# EAGLE schematic Beilage (EAGLE 9.6.2)
ABTEILUNG: Technische Informatik; BEARBEITER: Simon Grundner; DATUM: 2021//; DOKUMENTART: Schaltplan; GEZ: GruS; ID: 4AHEL; REV: 1; SCHALTPLAN: Sequencer; STATUS: Prototyp; VER: 2.0

## Sheet 1 of 5: Master Control
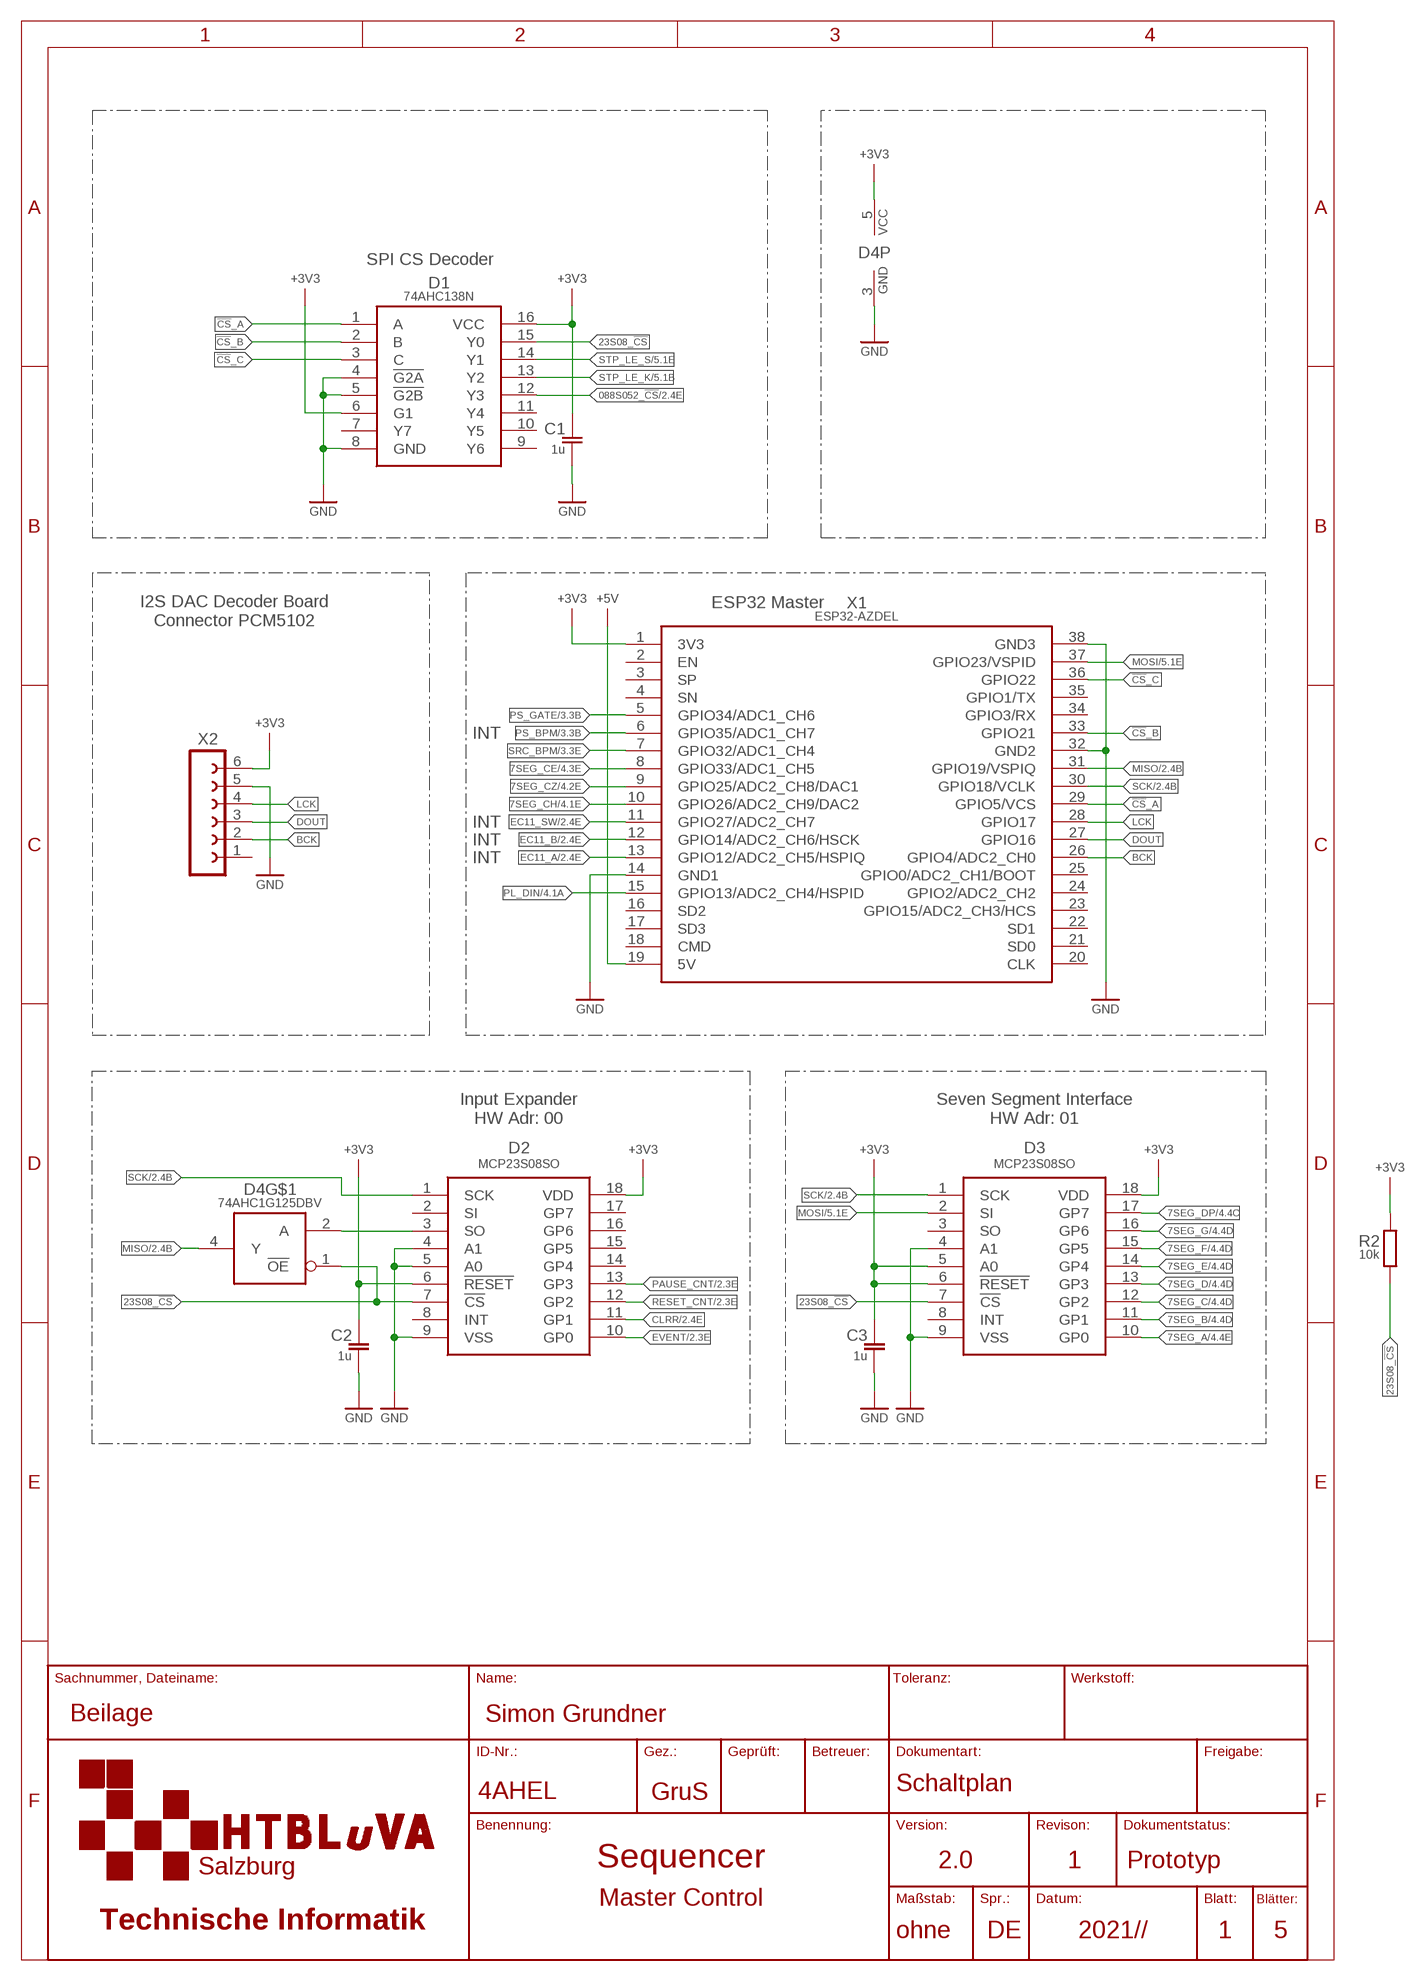
[diagram p0: schematic, sheet 1]

### Parts
C1  1u  C-EUC0805  [C0805]
C2  1u  C-EUC0805  [C0805]
C3  1u  C-EUC0805  [C0805]
D1  74AHC138N  [DIP16]
D2  MCP23S08SO  [SO18W]
D3  MCP23S08SO  [SO18W]
D4  74AHC1G125DBV  [SOT23-5]
R2  10k  R-EUSR0805  [R0805]
X1  ESP32-AZDEL  [ESP32-AZDEL]
X2  FE06-1  [FE06]

### Nets
7SEG_A: D3.10(GP0) ; also sheet 4
7SEG_B: D3.11(GP1) ; also sheet 4
7SEG_C: D3.12(GP2) ; also sheet 4
7SEG_CE: X1.8(GPIO33/ADC1_CH5) ; also sheet 4
7SEG_CH: X1.10(GPIO26/ADC2_CH9/DAC2) ; also sheet 4
7SEG_CZ: X1.9(GPIO25/ADC2_CH8/DAC1) ; also sheet 4
7SEG_D: D3.13(GP3) ; also sheet 4
7SEG_DP: D3.17(GP7) ; also sheet 4
7SEG_E: D3.14(GP4) ; also sheet 4
7SEG_F: D3.15(GP5) ; also sheet 4
7SEG_G: D3.16(GP6) ; also sheet 4
23S08_!CS: D1.15(Y0) D2.7(!CS) D3.7(!CS) D4.1(!OE) R2.1
088S052_!CS!: D1.12(Y3) ; also sheet 2
!CS!_A: D1.1(A) X1.29(GPIO5/VCS)
!CS!_B: D1.2(B) X1.33(GPIO21)
!CS!_C: D1.3(C) X1.36(GPIO22)
+3V3: C1.1 C2.1 C3.1 D1.6(G1) D1.16(VCC) D2.6(!RESET) D2.18(VDD) D3.5(A0) D3.6(!RESET) D3.18(VDD) D4.5(P:VCC) R2.2 X1.1(3V3) X2.6 ; also sheet 2,3,5
+5V: X1.19(5V) ; also sheet 4
BCK: X1.26(GPIO4/ADC2_CH0) X2.2
CLRR: D2.11(GP1) ; also sheet 2
DOUT: X1.27(GPIO16) X2.3
EC11_A: X1.13(GPIO12/ADC2_CH5/HSPIQ) ; also sheet 2
EC11_B: X1.12(GPIO14/ADC2_CH6/HSCK) ; also sheet 2
EC11_SW: X1.11(GPIO27/ADC2_CH7) ; also sheet 2
EVENT: D2.10(GP0) ; also sheet 2
GND: C1.2 C2.2 C3.2 D1.4(!G2A) D1.5(!G2B) D1.8(GND) D2.4(A1) D2.5(A0) D2.9(VSS) D3.4(A1) D3.9(VSS) D4.3(P:GND) X1.14(GND1) X1.32(GND2) X1.38(GND3) X2.5 ; also sheet 2,3,4,5
LCK: X1.28(GPIO17) X2.4
MISO: D4.4(Y) X1.31(GPIO19/VSPIQ) ; also sheet 2
MOSI: D3.2(SI) X1.37(GPIO23/VSPID) ; also sheet 5
N$62: D2.3(SO) D4.2(A)
PAUSE_CNT: D2.13(GP3) ; also sheet 2
PL_DIN: X1.15(GPIO13/ADC2_CH4/HSPID) ; also sheet 4
PS_BPM: X1.6(GPIO35/ADC1_CH7) ; also sheet 3
PS_GATE: X1.5(GPIO34/ADC1_CH6) ; also sheet 3
RESET_CNT: D2.12(GP2) ; also sheet 2
SCK: D2.1(SCK) D3.1(SCK) X1.30(GPIO18/VCLK) ; also sheet 2,5
SRC_BPM: X1.7(GPIO32/ADC1_CH4) ; also sheet 3
STP_LE_K: D1.13(Y2) ; also sheet 5
STP_LE_S: D1.14(Y1) ; also sheet 5
Unconnected: D1.7(Y7) D1.9(Y6) D1.10(Y5) D1.11(Y4) D2.2(SI) D2.8(INT) D2.14(GP4) D2.15(GP5) D2.16(GP6) D2.17(GP7) D3.3(SO) D3.8(INT) X1.2(EN) X1.3(SP) X1.4(SN) X1.16(SD2) X1.17(SD3) X1.18(CMD) X1.20(CLK) X1.21(SD0) X1.22(SD1) X1.23(GPIO15/ADC2_CH3/HCS) X1.24(GPIO2/ADC2_CH2) X1.25(GPIO0/ADC2_CH1/BOOT) X1.34(GPIO3/RX) X1.35(GPIO1/TX) X2.1

### Notes on the sheet
- SPI CS Decoder
- ESP32 Master
- I2S DAC Decoder Board
  Connector PCM5102
- INT
- INT
- INT
- INT
- Input Expander
  HW Adr: 00
- Seven Segment Interface
  HW Adr: 01

## Sheet 2 of 5: User Inputs Potentiometers for Pitch Settings Switch Inputs EC-11
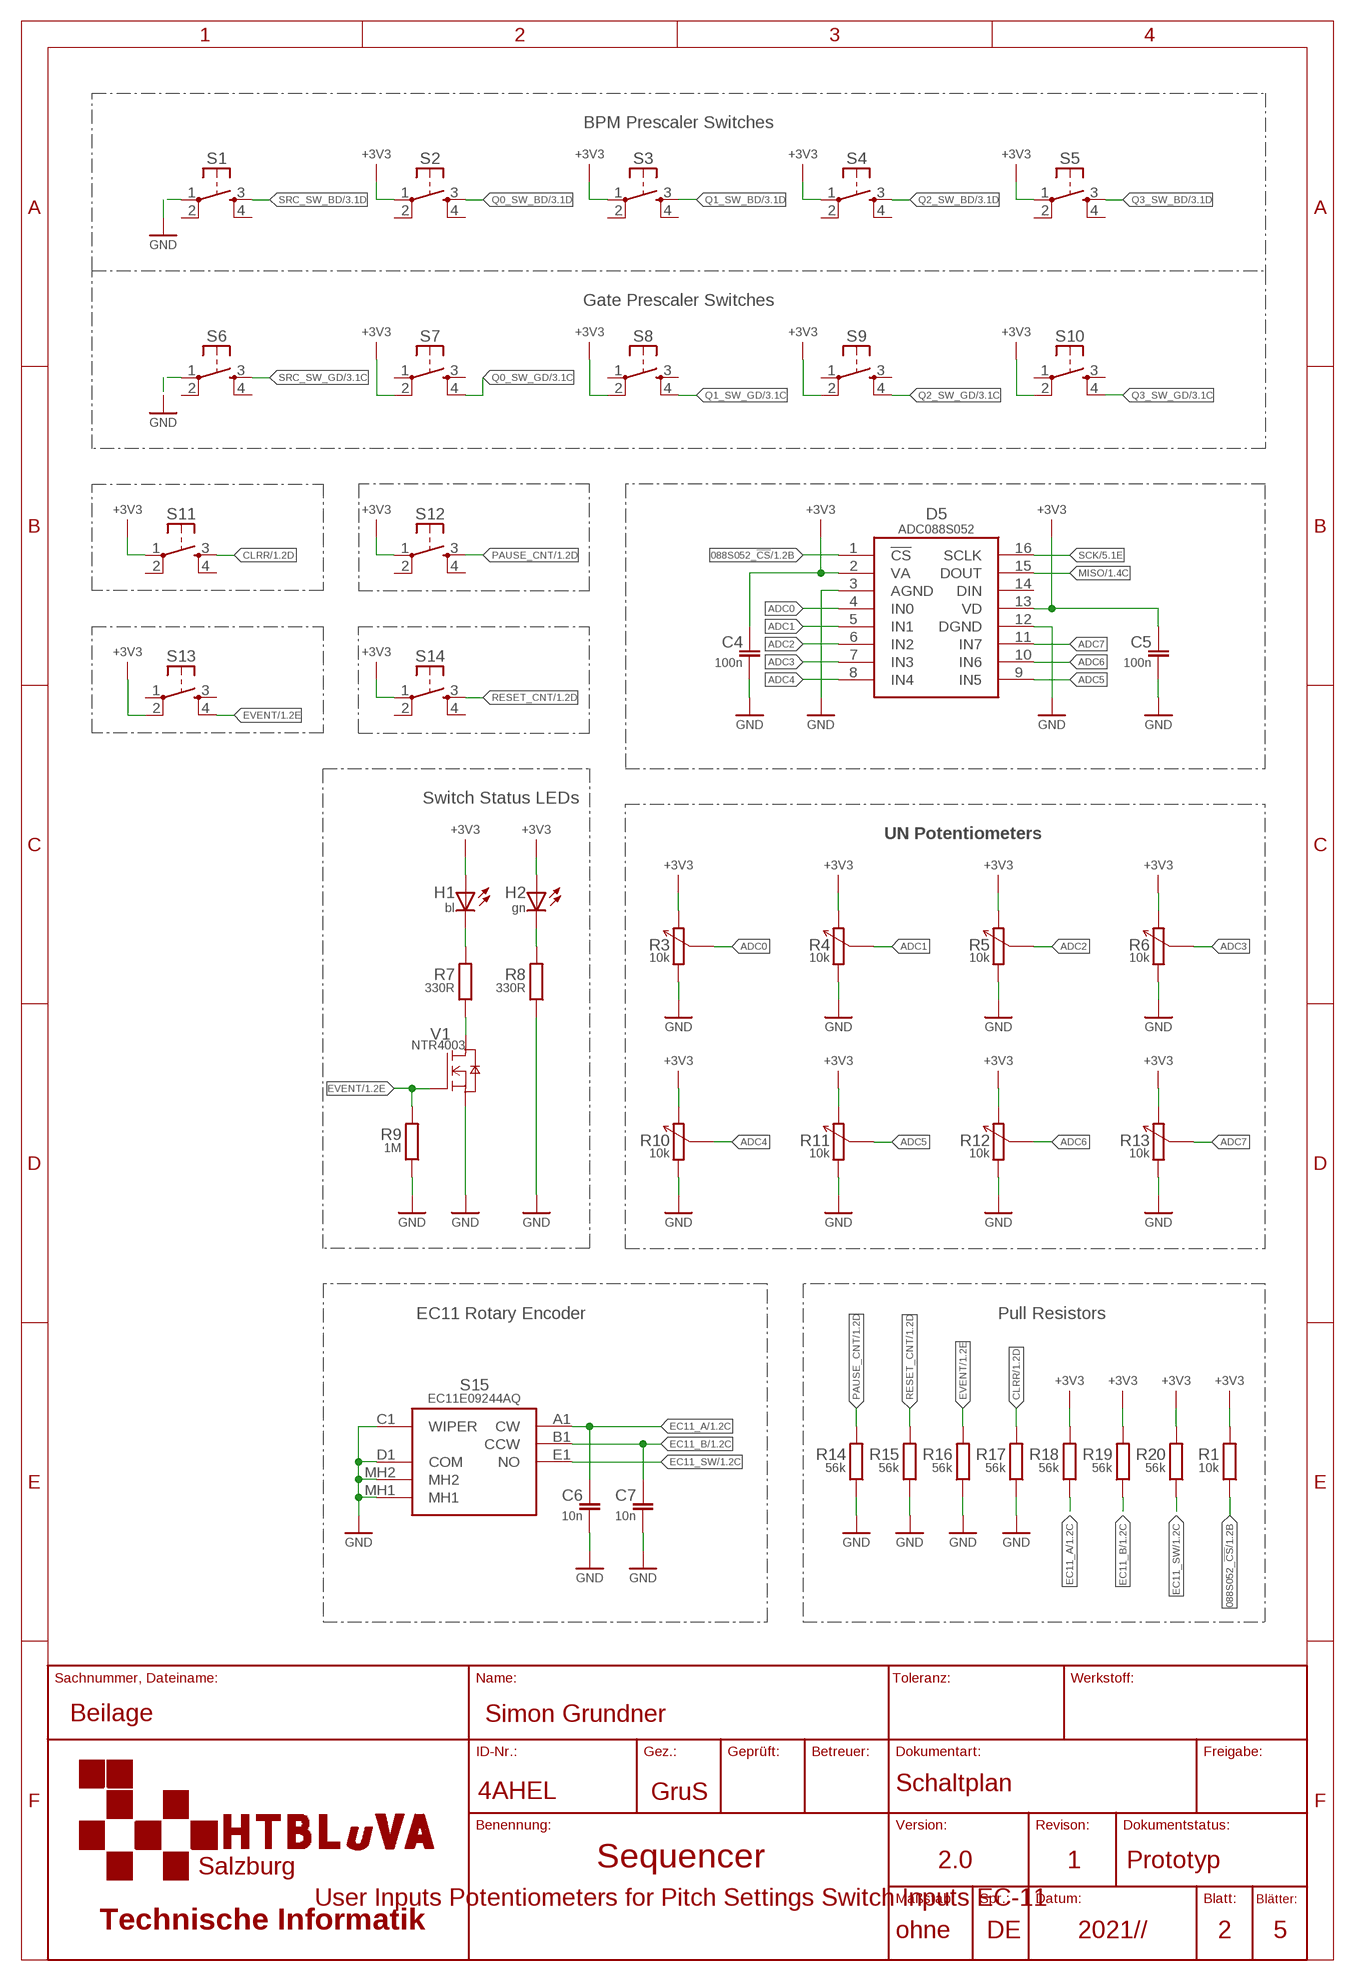
[diagram p1: schematic, sheet 2]

### Parts
C4  100n  C-EUC0805  [C0805]
C5  100n  C-EUC0805  [C0805]
C6  10n  C-EUC0805  [C0805]
C7  10n  C-EUC0805  [C0805]
D5  ADC088S052  [TSSOP16]
H1  bl  LEDCHIPLED_1206  [CHIPLED_1206]
H2  gn  LEDCHIPLED_1206  [CHIPLED_1206]
R1  10k  R-EUSR0805  [R0805]
R3  10k  P160L  [P160L]
R4  10k  P160L  [P160L]
R5  10k  P160L  [P160L]
R6  10k  P160L  [P160L]
R7  330R  R-EUSR0805  [R0805]
R8  330R  R-EUSR0805  [R0805]
R9  1M  R-EUSR0805  [R0805]
R10  10k  P160L  [P160L]
R11  10k  P160L  [P160L]
R12  10k  P160L  [P160L]
R13  10k  P160L  [P160L]
R14  56k  R-EUSR0805  [R0805]
R15  56k  R-EUSR0805  [R0805]
R16  56k  R-EUSR0805  [R0805]
R17  56k  R-EUSR0805  [R0805]
R18  56k  R-EUSR0805  [R0805]
R19  56k  R-EUSR0805  [R0805]
R20  56k  R-EUSR0805  [R0805]
S1  TASTE10XX  [B3F-10XX]
S2  TASTE10XX  [B3F-10XX]
S3  TASTE10XX  [B3F-10XX]
S4  TASTE10XX  [B3F-10XX]
S5  TASTE10XX  [B3F-10XX]
S6  TASTE10XX  [B3F-10XX]
S7  TASTE10XX  [B3F-10XX]
S8  TASTE10XX  [B3F-10XX]
S9  TASTE10XX  [B3F-10XX]
S10  TASTE10XX  [B3F-10XX]
S11  TASTE10XX  [B3F-10XX]
S12  TASTE10XX  [B3F-10XX]
S13  TASTE10XX  [B3F-10XX]
S14  TASTE10XX  [B3F-10XX]
S15  EC11E09244AQ  [EC11]
V1  NTR4003  [SOT23]

### Nets
088S052_!CS!: D5.1(!CS) R1.1 ; also sheet 1
+3V3: C4.1 C5.1 D5.2(VA) D5.13(VD) H1.A H2.A R1.2 R3.3 R4.3 R5.3 R6.3 R10.3 R11.3 R12.3 R13.3 R18.2 R19.2 R20.2 S2.1(P) S3.1(P) S4.1(P) S5.1(P) S7.2(P1) S8.2(P1) S9.2(P1) S10.2(P1) S11.1(P) S12.1(P) S13.2(P1) S14.1(P) ; also sheet 1,3,5
ADC0: D5.4(IN0) R3.2
ADC1: D5.5(IN1) R4.2
ADC2: D5.6(IN2) R5.2
ADC3: D5.7(IN3) R6.2
ADC4: D5.8(IN4) R10.2
ADC5: D5.9(IN5) R11.2
ADC6: D5.10(IN6) R12.2
ADC7: D5.11(IN7) R13.2
CLRR: R17.2 S11.3(S) ; also sheet 1
EC11_A: C6.1 R18.1 S15.A1(CW) ; also sheet 1
EC11_B: C7.1 R19.1 S15.B1(CCW) ; also sheet 1
EC11_SW: R20.1 S15.E1(NO) ; also sheet 1
EVENT: R9.2 R16.2 S13.4(S1) V1.1(G) ; also sheet 1
GND: C4.2 C5.2 C6.2 C7.2 D5.3(AGND) D5.12(DGND) R3.1 R4.1 R5.1 R6.1 R8.1 R9.1 R10.1 R11.1 R12.1 R13.1 R14.1 R15.1 R16.1 R17.1 S1.1(P) S6.1(P) S15.C1(WIPER) S15.D1(COM) S15.MH1 S15.MH2 V1.2(S) ; also sheet 1,3,4,5
MISO: D5.15(DOUT) ; also sheet 1
N$9: H2.C R8.2
N$58: H1.C R7.2
N$60: R7.1 V1.3(D)
PAUSE_CNT: R14.2 S12.3(S) ; also sheet 1
Q0_SW_BD: S2.3(S) ; also sheet 3
Q0_SW_GD: S7.4(S1) ; also sheet 3
Q1_SW_BD: S3.3(S) ; also sheet 3
Q1_SW_GD: S8.4(S1) ; also sheet 3
Q2_SW_BD: S4.3(S) ; also sheet 3
Q2_SW_GD: S9.4(S1) ; also sheet 3
Q3_SW_BD: S5.3(S) ; also sheet 3
Q3_SW_GD: S10.4(S1) ; also sheet 3
RESET_CNT: R15.2 S14.3(S) ; also sheet 1
SCK: D5.16(SCLK) ; also sheet 1,5
SRC_SW_BD: S1.3(S) ; also sheet 3
SRC_SW_GD: S6.3(S) ; also sheet 3
Unconnected: D5.14(DIN) S1.2(P1) S1.4(S1) S2.2(P1) S2.4(S1) S3.2(P1) S3.4(S1) S4.2(P1) S4.4(S1) S5.2(P1) S5.4(S1) S6.2(P1) S6.4(S1) S7.1(P) S7.3(S) S8.1(P) S8.3(S) S9.1(P) S9.3(S) S10.1(P) S10.3(S) S11.2(P1) S11.4(S1) S12.2(P1) S12.4(S1) S13.1(P) S13.3(S) S14.2(P1) S14.4(S1)

### Notes on the sheet
- BPM Prescaler Switches
- Gate Prescaler Switches
- Switch Status LEDs
- UN Potentiometers
- EC11 Rotary Encoder | Pull Resistors

## Sheet 3 of 5: Switch Matrix Switch Matrices for Division Factors
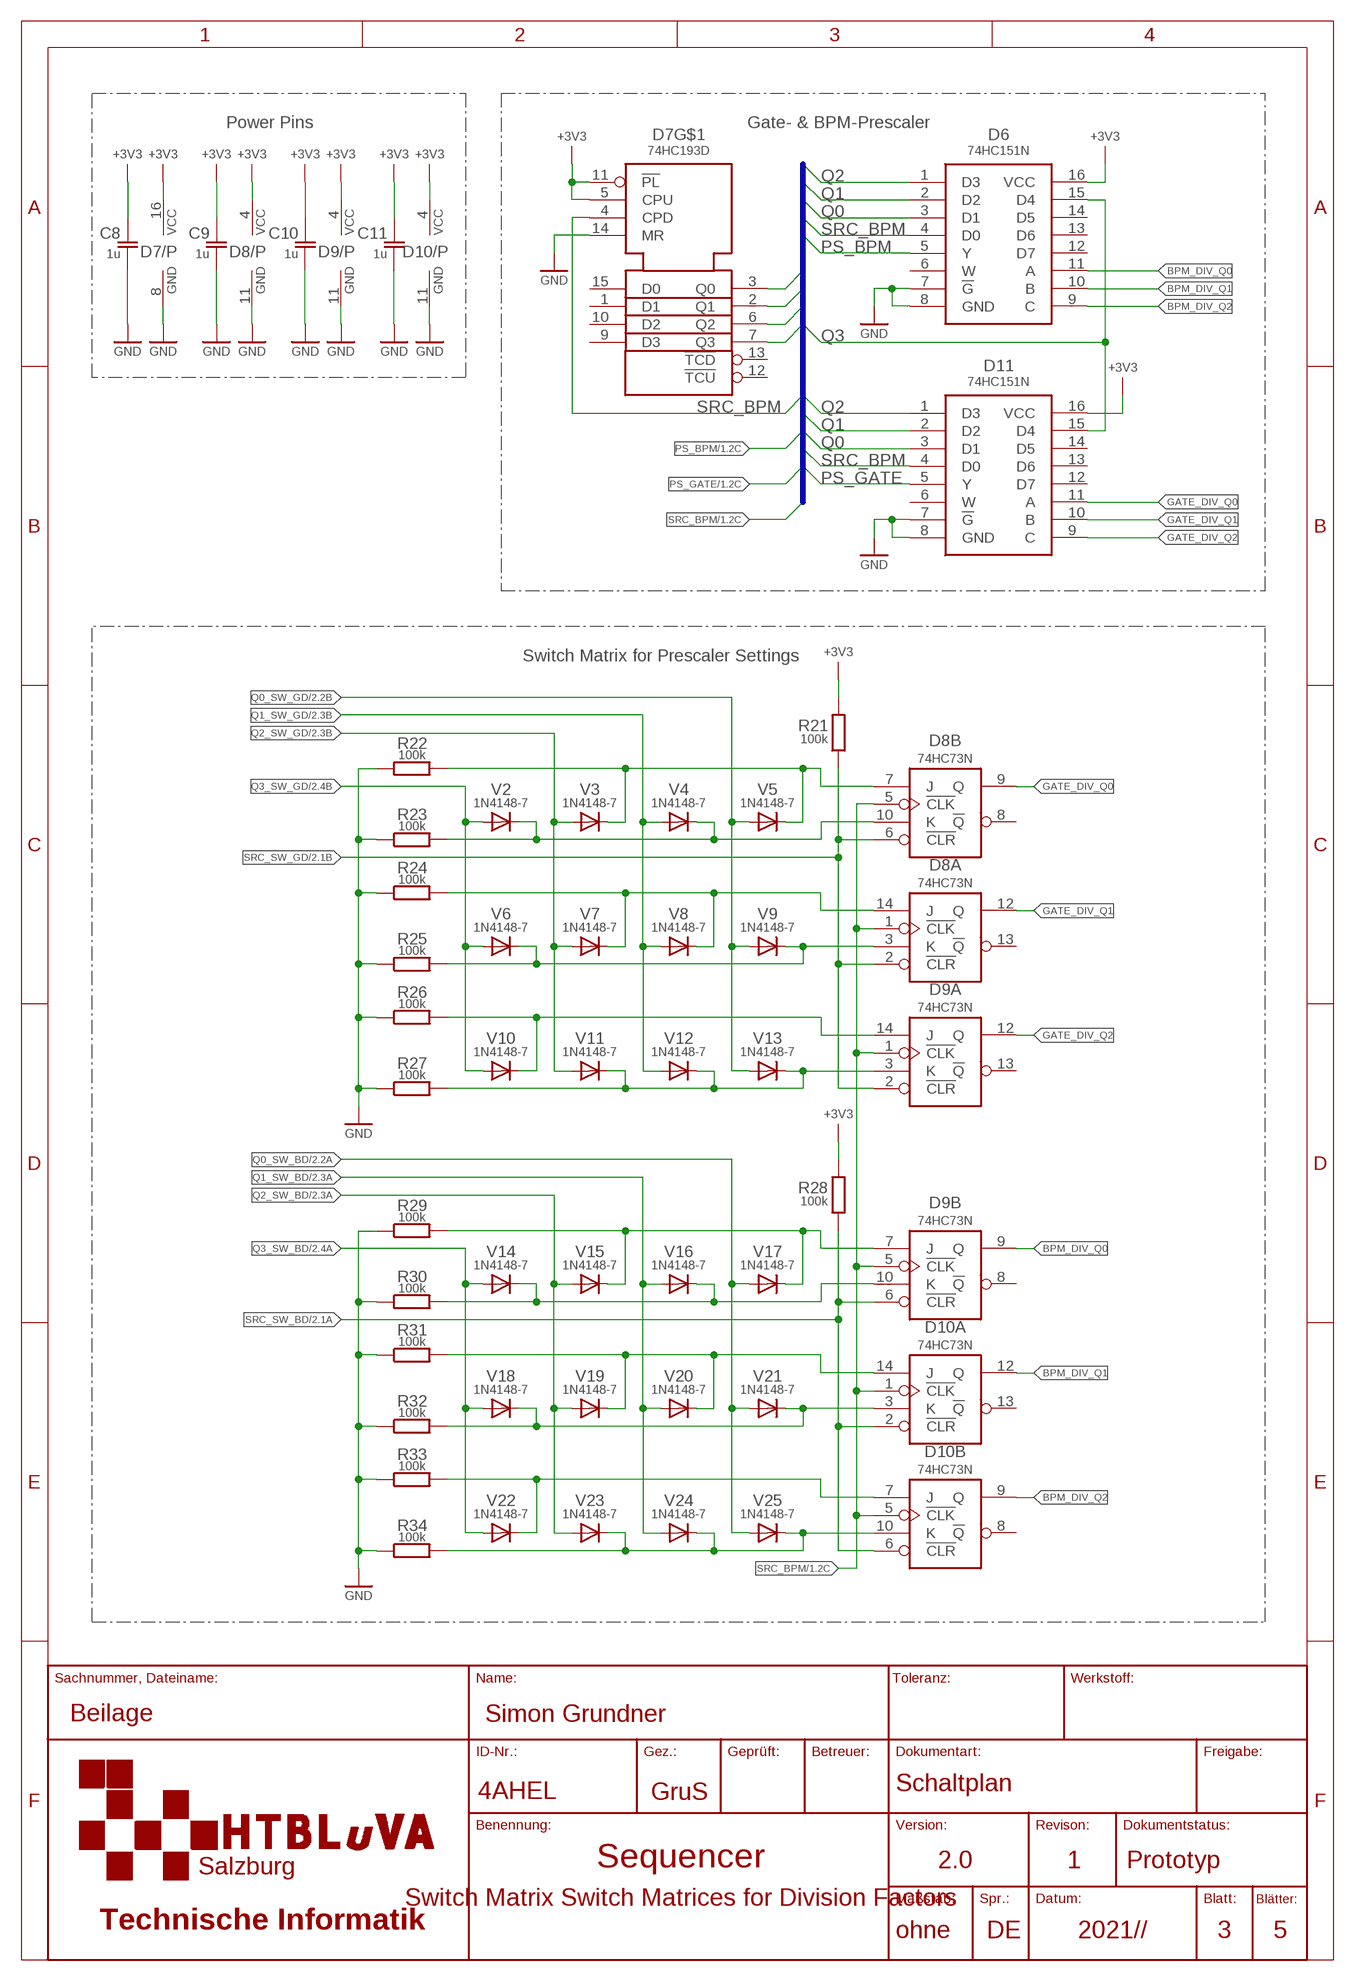
[diagram p2: schematic, sheet 3]

### Parts
C8  1u  C-EUC0805  [C0805]
C9  1u  C-EUC0805  [C0805]
C10  1u  C-EUC0805  [C0805]
C11  1u  C-EUC0805  [C0805]
D6  74HC151N  [DIP16]
D7  74HC193D  [SO16]
D8  74HC73N  [DIP14]
D9  74HC73N  [DIP14]
D10  74HC73N  [DIP14]
D11  74HC151N  [DIP16]
R21  100k  R-EUSR0805  [R0805]
R22  100k  R-EU_R0805  [R0805]
R23  100k  R-EU_R0805  [R0805]
R24  100k  R-EU_R0805  [R0805]
R25  100k  R-EU_R0805  [R0805]
R26  100k  R-EU_R0805  [R0805]
R27  100k  R-EU_R0805  [R0805]
R28  100k  R-EUSR0805  [R0805]
R29  100k  R-EU_R0805  [R0805]
R30  100k  R-EU_R0805  [R0805]
R31  100k  R-EU_R0805  [R0805]
R32  100k  R-EU_R0805  [R0805]
R33  100k  R-EU_R0805  [R0805]
R34  100k  R-EU_R0805  [R0805]
V2  1N4148-7  [DO35-7]
V3  1N4148-7  [DO35-7]
V4  1N4148-7  [DO35-7]
V5  1N4148-7  [DO35-7]
V6  1N4148-7  [DO35-7]
V7  1N4148-7  [DO35-7]
V8  1N4148-7  [DO35-7]
V9  1N4148-7  [DO35-7]
V10  1N4148-7  [DO35-7]
V11  1N4148-7  [DO35-7]
V12  1N4148-7  [DO35-7]
V13  1N4148-7  [DO35-7]
V14  1N4148-7  [DO35-7]
V15  1N4148-7  [DO35-7]
V16  1N4148-7  [DO35-7]
V17  1N4148-7  [DO35-7]
V18  1N4148-7  [DO35-7]
V19  1N4148-7  [DO35-7]
V20  1N4148-7  [DO35-7]
V21  1N4148-7  [DO35-7]
V22  1N4148-7  [DO35-7]
V23  1N4148-7  [DO35-7]
V24  1N4148-7  [DO35-7]
V25  1N4148-7  [DO35-7]

### Nets
+3V3: C8.1 C9.1 C10.1 C11.1 D6.16(VCC) D7.5(CPU) D7.11(!PL) D7.16(/P:VCC) D8.4(/P:VCC) D9.4(/P:VCC) D10.4(/P:VCC) D11.16(VCC) R21.2 R28.2 ; also sheet 1,2,5
BPM_DIV_Q0: D6.11(A) D9.9(B:Q)
BPM_DIV_Q1: D6.10(B) D10.12(A:Q)
BPM_DIV_Q2: D6.9(C) D10.9(B:Q)
GATE_DIV_Q0: D8.9(B:Q) D11.11(A)
GATE_DIV_Q1: D8.12(A:Q) D11.10(B)
GATE_DIV_Q2: D9.12(A:Q) D11.9(C)
GND: C8.2 C9.2 C10.2 C11.2 D6.7(!G) D6.8(GND) D7.8(/P:GND) D7.14(MR) D8.11(/P:GND) D9.11(/P:GND) D10.11(/P:GND) D11.7(!G) D11.8(GND) R22.1 R23.1 R24.1 R25.1 R26.1 R27.1 R29.1 R30.1 R31.1 R32.1 R33.1 R34.1 ; also sheet 1,2,4,5
N$1: D9.14(A:J) R26.2 V10.C
N$2: D8.10(B:K) R23.2 V2.C V4.C
N$3: D8.14(A:J) R24.2 V7.C V8.C
N$5: D8.7(B:J) R22.2 V3.C V5.C
N$6: D9.3(A:K) R27.2 V11.C V12.C V13.C
N$14: D8.3(A:K) R25.2 V6.C V9.C
N$15: D9.10(B:K) R30.2 V14.C V16.C
N$16: D10.10(B:K) R34.2 V23.C V24.C V25.C
N$17: D10.7(B:J) R33.2 V22.C
N$18: D10.14(A:J) R31.2 V19.C V20.C
N$19: D9.7(B:J) R29.2 V15.C V17.C
N$34: D10.3(A:K) R32.2 V18.C V21.C
PS_BPM: D6.5(Y) ; also sheet 1
PS_GATE: D11.5(Y) ; also sheet 1
Q0: D6.3(D1) D7.3(Q0) D11.3(D1)
Q0_SW_BD: V17.A V21.A V25.A ; also sheet 2
Q0_SW_GD: V5.A V9.A V13.A ; also sheet 2
Q1: D6.2(D2) D7.2(Q1) D11.2(D2)
Q1_SW_BD: V16.A V20.A V24.A ; also sheet 2
Q1_SW_GD: V4.A V8.A V12.A ; also sheet 2
Q2: D6.1(D3) D7.6(Q2) D11.1(D3)
Q2_SW_BD: V15.A V19.A V23.A ; also sheet 2
Q2_SW_GD: V3.A V7.A V11.A ; also sheet 2
Q3: D6.15(D4) D7.7(Q3) D11.15(D4)
Q3_SW_BD: V14.A V18.A V22.A ; also sheet 2
Q3_SW_GD: V2.A V6.A V10.A ; also sheet 2
SRC_BPM: D6.4(D0) D7.4(CPD) D8.1(A:!CLK) D8.5(B:!CLK) D9.1(A:!CLK) D9.5(B:!CLK) D10.1(A:!CLK) D10.5(B:!CLK) D11.4(D0) ; also sheet 1
SRC_SW_BD: D9.6(B:!CLR) D10.2(A:!CLR) D10.6(B:!CLR) R28.1 ; also sheet 2
SRC_SW_GD: D8.2(A:!CLR) D8.6(B:!CLR) D9.2(A:!CLR) R21.1 ; also sheet 2
Unconnected: D6.6(W) D6.12(D7) D6.13(D6) D6.14(D5) D7.1(D1) D7.9(D3) D7.10(D2) D7.12(!TCU) D7.13(!TCD) D7.15(D0) D8.8(B:!Q) D8.13(A:!Q) D9.8(B:!Q) D9.13(A:!Q) D10.8(B:!Q) D10.13(A:!Q) D11.6(W) D11.12(D7) D11.13(D6) D11.14(D5)

### Buses
PS_BPM,PS_GATE,Q0,Q1,Q2,Q3,SRC_BPM

### Notes on the sheet
- Power Pins | Gate- & BPM-Prescaler
- Switch Matrix for Prescaler Settings

## Sheet 4 of 5: Display & LEDs PL9823-F5 Rotating LEDs 7 Segment Display
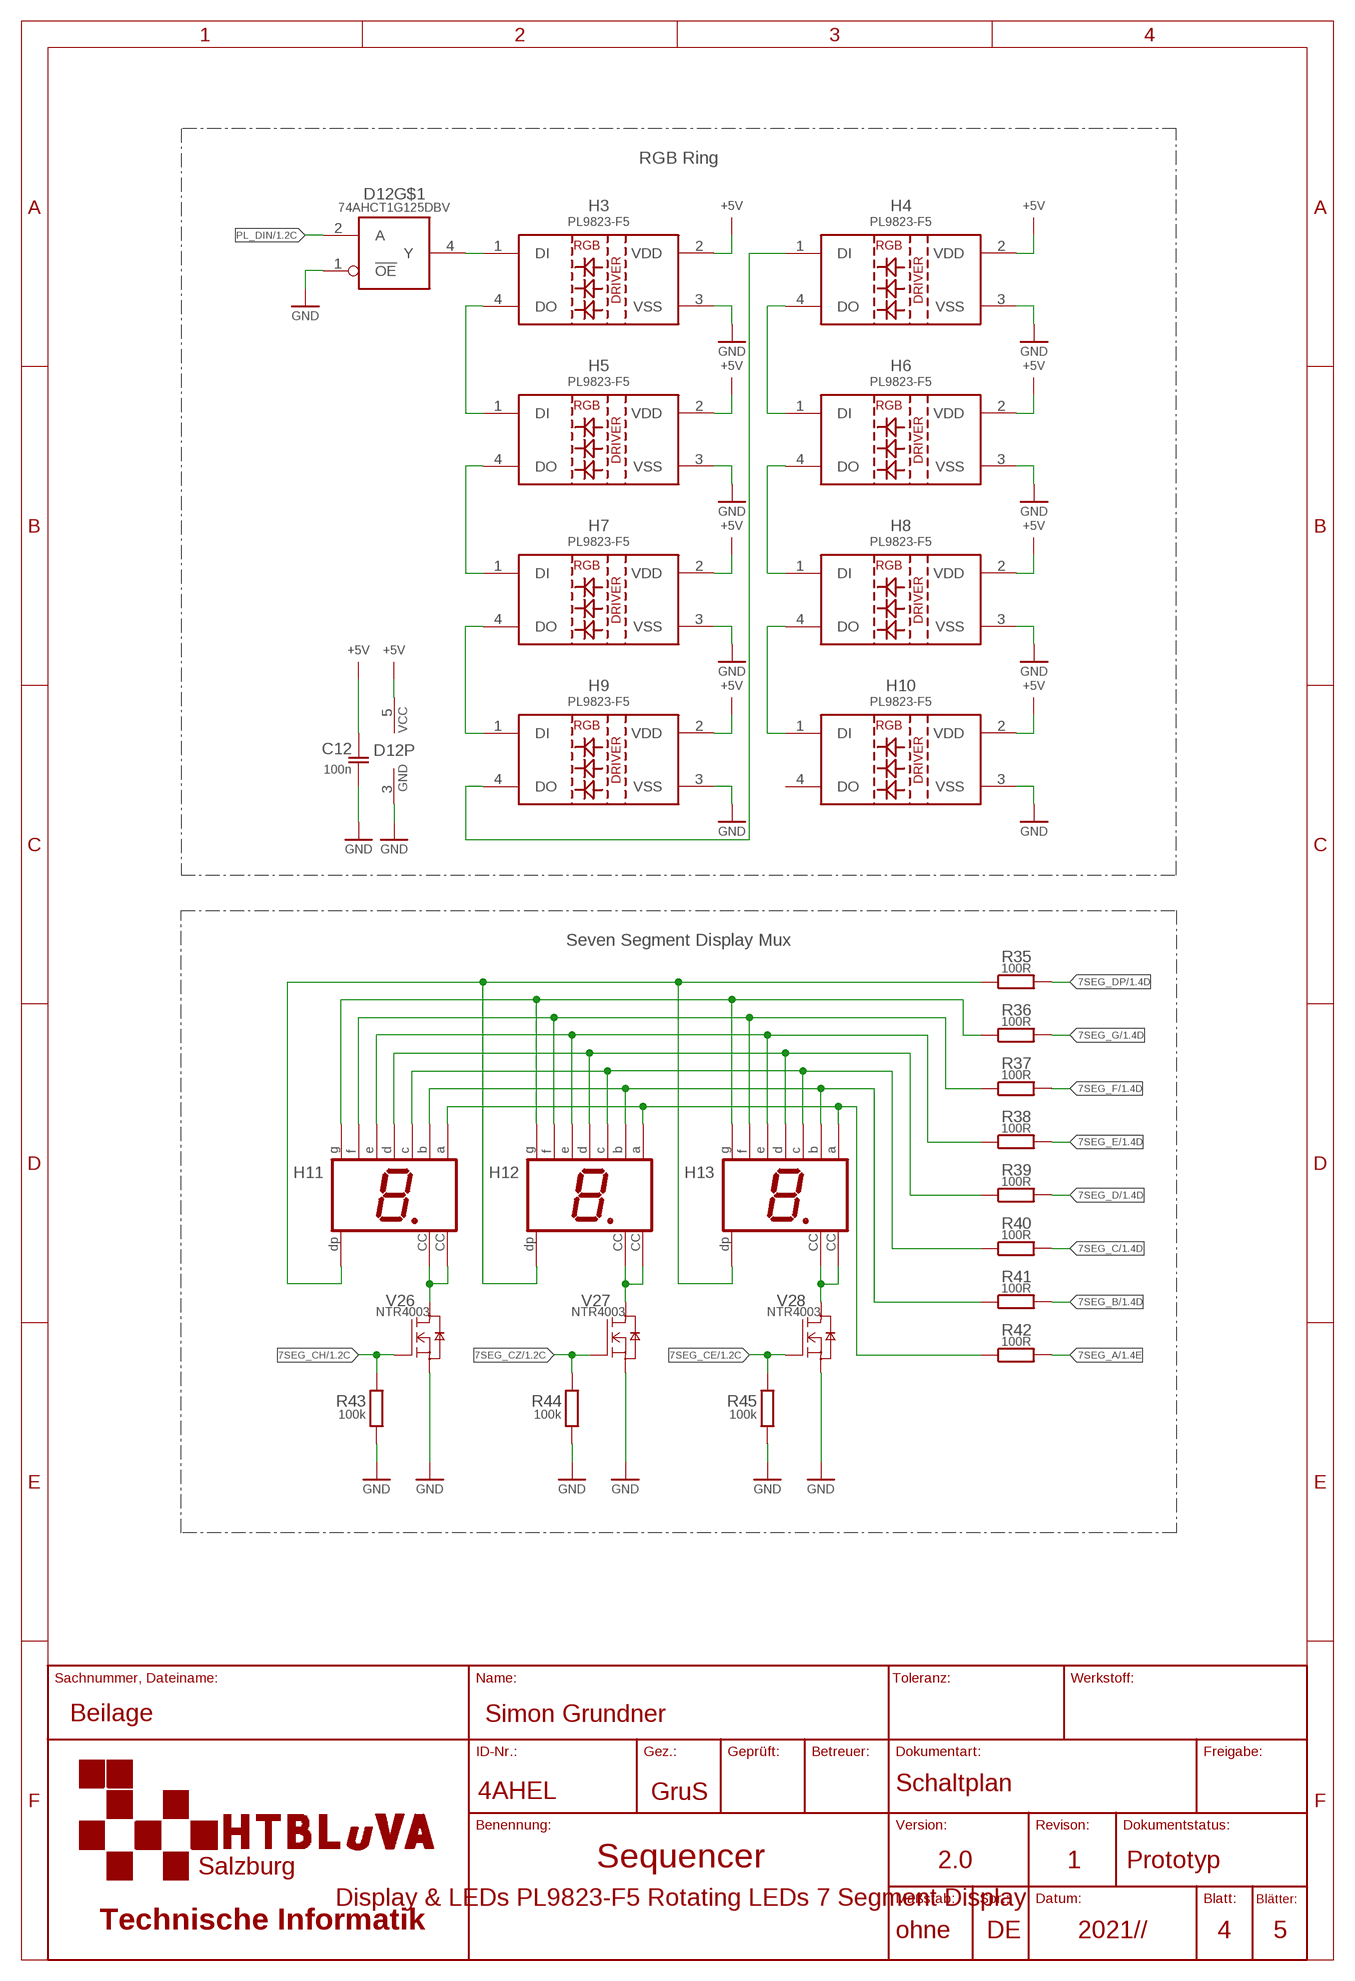
[diagram p3: schematic, sheet 4]

### Parts
C12  100n  C-EUC0805  [C0805]
D12  74AHCT1G125DBV  [SOT23-5]
H3  PL9823-F5  [LED-PL9823-F5]
H4  PL9823-F5  [LED-PL9823-F5]
H5  PL9823-F5  [LED-PL9823-F5]
H6  PL9823-F5  [LED-PL9823-F5]
H7  PL9823-F5  [LED-PL9823-F5]
H8  PL9823-F5  [LED-PL9823-F5]
H9  PL9823-F5  [LED-PL9823-F5]
H10  PL9823-F5  [LED-PL9823-F5]
H11  HD-H103  [HDSP-E]
H12  HD-H103  [HDSP-E]
H13  HD-H103  [HDSP-E]
R35  100R  R-EU_R0805  [R0805]
R36  100R  R-EU_R0805  [R0805]
R37  100R  R-EU_R0805  [R0805]
R38  100R  R-EU_R0805  [R0805]
R39  100R  R-EU_R0805  [R0805]
R40  100R  R-EU_R0805  [R0805]
R41  100R  R-EU_R0805  [R0805]
R42  100R  R-EU_R0805  [R0805]
R43  100k  R-EUSR0805  [R0805]
R44  100k  R-EUSR0805  [R0805]
R45  100k  R-EUSR0805  [R0805]
V26  NTR4003  [SOT23]
V27  NTR4003  [SOT23]
V28  NTR4003  [SOT23]

### Nets
7SEG_A: R42.2 ; also sheet 1
7SEG_B: R41.2 ; also sheet 1
7SEG_C: R40.2 ; also sheet 1
7SEG_CE: R45.2 V28.1(G) ; also sheet 1
7SEG_CH: R43.2 V26.1(G) ; also sheet 1
7SEG_CZ: R44.2 V27.1(G) ; also sheet 1
7SEG_D: R39.2 ; also sheet 1
7SEG_DP: R35.2 ; also sheet 1
7SEG_E: R38.2 ; also sheet 1
7SEG_F: R37.2 ; also sheet 1
7SEG_G: R36.2 ; also sheet 1
+5V: C12.1 D12.5(P:VCC) H3.2(VDD) H4.2(VDD) H5.2(VDD) H6.2(VDD) H7.2(VDD) H8.2(VDD) H9.2(VDD) H10.2(VDD) ; also sheet 1
GND: C12.2 D12.1(!OE) D12.3(P:GND) H3.3(VSS) H4.3(VSS) H5.3(VSS) H6.3(VSS) H7.3(VSS) H8.3(VSS) H9.3(VSS) H10.3(VSS) R43.1 R44.1 R45.1 V26.2(S) V27.2(S) V28.2(S) ; also sheet 1,2,3,5
N$4: H4.1(DI) H9.4(DO)
N$7: H11.DP H12.DP H13.DP R35.1
N$8: D12.4(Y) H3.1(DI)
N$33: H11.G H12.G H13.G R36.1
N$35: H11.F H12.F H13.F R37.1
N$36: H11.A H12.A H13.A R42.1
N$37: H11.B H12.B H13.B R41.1
N$55: H11.CC1(CC) H11.CC2(CC) V26.3(D)
N$56: H11.D H12.D H13.D R39.1
N$57: H4.4(DO) H6.1(DI)
N$59: H6.4(DO) H8.1(DI)
N$63: H8.4(DO) H10.1(DI)
N$64: H12.CC1(CC) H12.CC2(CC) V27.3(D)
N$65: H13.CC1(CC) H13.CC2(CC) V28.3(D)
N$68: H3.4(DO) H5.1(DI)
N$70: H5.4(DO) H7.1(DI)
N$73: H7.4(DO) H9.1(DI)
N$78: H11.C H12.C H13.C R40.1
N$80: H11.E H12.E H13.E R38.1
PL_DIN: D12.2(A) ; also sheet 1
Unconnected: H10.4(DO)

### Notes on the sheet
- RGB Ring
- Seven Segment Display Mux

## Sheet 5 of 5: LED Driver LED Register PL-9823-F5 LEDs
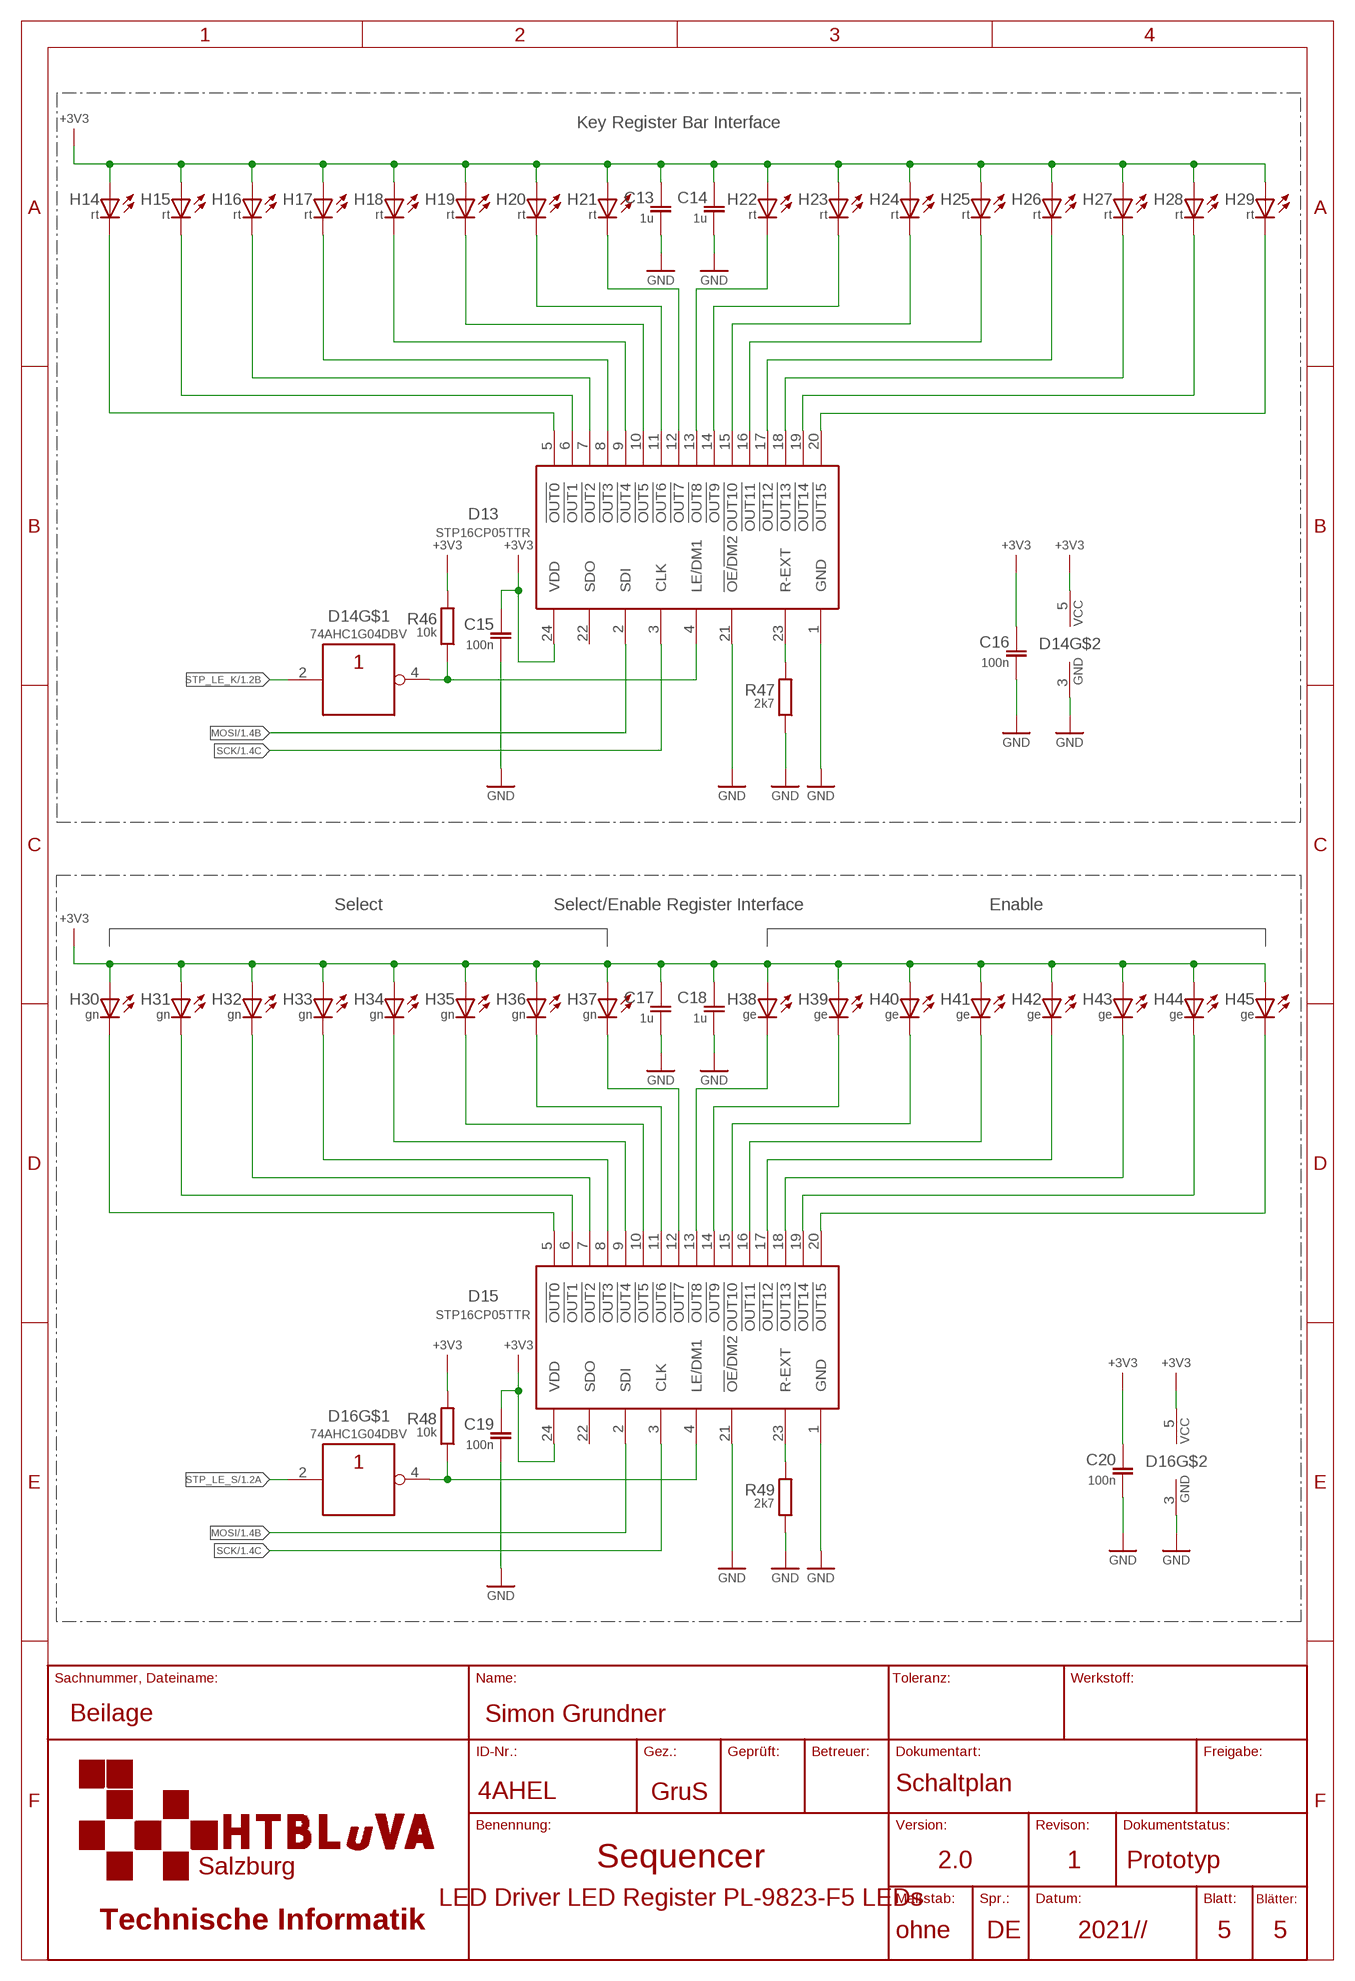
[diagram p4: schematic, sheet 5]

### Parts
C13  1u  C-EUC0805  [C0805]
C14  1u  C-EUC0805  [C0805]
C15  100n  C-EUC0805  [C0805]
C16  100n  C-EUC0805  [C0805]
C17  1u  C-EUC0805  [C0805]
C18  1u  C-EUC0805  [C0805]
C19  100n  C-EUC0805  [C0805]
C20  100n  C-EUC0805  [C0805]
D13  STP16CP05TTR  [TSSOP24]
D14  74AHC1G04DBV  [SOT23-5]
D15  STP16CP05TTR  [TSSOP24]
D16  74AHC1G04DBV  [SOT23-5]
H14  rt  LEDCHIPLED_1206  [CHIPLED_1206]
H15  rt  LEDCHIPLED_1206  [CHIPLED_1206]
H16  rt  LEDCHIPLED_1206  [CHIPLED_1206]
H17  rt  LEDCHIPLED_1206  [CHIPLED_1206]
H18  rt  LEDCHIPLED_1206  [CHIPLED_1206]
H19  rt  LEDCHIPLED_1206  [CHIPLED_1206]
H20  rt  LEDCHIPLED_1206  [CHIPLED_1206]
H21  rt  LEDCHIPLED_1206  [CHIPLED_1206]
H22  rt  LEDCHIPLED_1206  [CHIPLED_1206]
H23  rt  LEDCHIPLED_1206  [CHIPLED_1206]
H24  rt  LEDCHIPLED_1206  [CHIPLED_1206]
H25  rt  LEDCHIPLED_1206  [CHIPLED_1206]
H26  rt  LEDCHIPLED_1206  [CHIPLED_1206]
H27  rt  LEDCHIPLED_1206  [CHIPLED_1206]
H28  rt  LEDCHIPLED_1206  [CHIPLED_1206]
H29  rt  LEDCHIPLED_1206  [CHIPLED_1206]
H30  gn  LED5MM  [LED5MM]
H31  gn  LED5MM  [LED5MM]
H32  gn  LED5MM  [LED5MM]
H33  gn  LED5MM  [LED5MM]
H34  gn  LED5MM  [LED5MM]
H35  gn  LED5MM  [LED5MM]
H36  gn  LED5MM  [LED5MM]
H37  gn  LED5MM  [LED5MM]
H38  ge  LED5MM  [LED5MM]
H39  ge  LED5MM  [LED5MM]
H40  ge  LED5MM  [LED5MM]
H41  ge  LED5MM  [LED5MM]
H42  ge  LED5MM  [LED5MM]
H43  ge  LED5MM  [LED5MM]
H44  ge  LED5MM  [LED5MM]
H45  ge  LED5MM  [LED5MM]
R46  10k  R-EUSR0805  [R0805]
R47  2k7  R-EUSR0805  [R0805]
R48  10k  R-EUSR0805  [R0805]
R49  2k7  R-EUSR0805  [R0805]

### Nets
+3V3: C13.1 C14.1 C15.1 C16.1 C17.1 C18.1 C19.1 C20.1 D13.24(VDD) D14.5(VCC) D15.24(VDD) D16.5(VCC) H14.A H15.A H16.A H17.A H18.A H19.A H20.A H21.A H22.A H23.A H24.A H25.A H26.A H27.A H28.A H29.A H30.A H31.A H32.A H33.A H34.A H35.A H36.A H37.A H38.A H39.A H40.A H41.A H42.A H43.A H44.A H45.A R46.2 R48.2 ; also sheet 1,2,3
GND: C13.2 C14.2 C15.2 C16.2 C17.2 C18.2 C19.2 C20.2 D13.1(GND) D13.21(!OE!/!DM2) D14.3(GND) D15.1(GND) D15.21(!OE!/!DM2) D16.3(GND) R47.1 R49.1 ; also sheet 1,2,3,4
MOSI: D13.2(SDI) D15.2(SDI) ; also sheet 1
N$10: D13.5(!OUT0) H14.C
N$11: D13.6(!OUT1) H15.C
N$12: D13.7(!OUT2) H16.C
N$13: D13.8(!OUT3) H17.C
N$20: D13.9(!OUT4) H18.C
N$21: D13.10(!OUT5) H19.C
N$22: D13.11(!OUT6) H20.C
N$23: D13.12(!OUT7) H21.C
N$24: D13.23(R-EXT) R47.2
N$25: D13.13(!OUT8) H22.C
N$26: D13.14(!OUT9) H23.C
N$27: D13.15(!OUT10) H24.C
N$28: D13.16(!OUT11) H25.C
N$29: D13.17(!OUT12) H26.C
N$30: D13.18(!OUT13) H27.C
N$31: D13.19(!OUT14) H28.C
N$32: D13.20(!OUT15) H29.C
N$38: D15.5(!OUT0) H30.K(C)
N$39: D15.6(!OUT1) H31.K(C)
N$40: D15.7(!OUT2) H32.K(C)
N$41: D15.8(!OUT3) H33.K(C)
N$42: D15.9(!OUT4) H34.K(C)
N$43: D15.10(!OUT5) H35.K(C)
N$44: D15.11(!OUT6) H36.K(C)
N$45: D15.12(!OUT7) H37.K(C)
N$46: D15.13(!OUT8) H38.K(C)
N$47: D15.14(!OUT9) H39.K(C)
N$48: D15.15(!OUT10) H40.K(C)
N$49: D15.16(!OUT11) H41.K(C)
N$50: D15.17(!OUT12) H42.K(C)
N$51: D15.18(!OUT13) H43.K(C)
N$52: D15.19(!OUT14) H44.K(C)
N$53: D15.20(!OUT15) H45.K(C)
N$54: D15.23(R-EXT) R49.2
N$61: D15.4(LE/DM1) D16.4(Y) R48.1
N$66: D13.4(LE/DM1) D14.4(Y) R46.1
SCK: D13.3(CLK) D15.3(CLK) ; also sheet 1,2
STP_LE_K: D14.2(A) ; also sheet 1
STP_LE_S: D16.2(A) ; also sheet 1
Unconnected: D13.22(SDO) D15.22(SDO)

### Notes on the sheet
- Key Register Bar Interface
- Select | Select/Enable Register Interface | Enable

## Library data of the parts
C1 = rcl_GruS:C-EU: CAPACITOR, European symbol
C2-C20 = rcl_GruS:C-EU: CAPACITOR, European symbol; CATEGORY: 2
D1 = 74xx_GruS:74*138: 3-LINE TO 8-LINE DECODERS/DEMULTIPLEXERS Source: Datasheet
D2 D3 = ic_GruS:MCP23S08: 8-bit I/O Expander,SPI,MCP23S08-E/SO Source: Datasheet; ARROW_PART_NUMBER: MCP23S08-E/SO; ARROW_PRICE-STOCK: https://www.arrow.com/en/products/mcp23s08-eso/microchip-technology?region=nac; CATEGORY: 13; DESCRIPTION: 8-bit I/O Expander,SPI,MCP23S08-E/SO; HEIGHT: 2.65mm; MANUFACTURER_NAME: Microchip; MANUFACTURER_PART_NUMBER: MCP23S08-E/SO; MOUSER_PART_NUMBER: 579-MCP23S08-E/SO; MOUSER_PRICE-STOCK: https://www.mouser.co.uk/ProductDetail/Microchip-Technology/MCP23S08-E-SO?qs=Sez7gRs8XSXMFunLZ5Ve%2FA%3D%3D
D4 = 74xx_GruS:74*1G125: Single Bus Buffer Gate with 3-State Output
D5 = adc-dac_GruS:ADC088S052: 8-Channel, 200 ksps to 500 ksps, 8-Bit A/D Converter Source: Datasheet; ARROW_PART_NUMBER: ADC088S052CIMT/NOPB; ARROW_PRICE-STOCK: https://www.arrow.com/en/products/adc088s052cimtnopb/texas-instruments?region=nac; CATEGORY: 2; DESCRIPTION: 8-Channel, 200 ksps to 500 ksps, 8-Bit A/D Converter; HEIGHT: 1.2mm; MANUFACTURER_NAME: Texas Instruments; MANUFACTURER_PART_NUMBER: ADC088S052CIMT/NOPB; MOUSER_PART_NUMBER: 926-AD088S052CIMTNPB; MOUSER_PRICE-STOCK: https://www.mouser.co.uk/ProductDetail/Texas-Instruments/ADC088S052CIMT-NOPB?qs=7X5t%252BdzoRHDIs0QC27A8hw%3D%3D
D6 D11 = 74xx_GruS:74*151: Encoders, Decoders, Multiplexers & Demultiplexers 8-1 Line Data Selctr Source: Datasheet; CATEGORY: 13
D7 = 74xx_GruS:74*193: 74HC(T)193 - Presettable synchronous 4-bit binary up, down counter@en-us Source: Datasheet; CATEGORY: 13
D8-D10 = 74xx_GruS:74*73: Dual JK-FlipFlop Datasheet Dist.: Art. Nr.:; CATEGORY: 13
D12 = 74xx_GruS:74*1G125: Single Bus Buffer Gate with 3-State Output; CATEGORY: 13
D13 D15 = ic_GruS:STP16CP05: STP16CP05 Source: Datasheet; CATEGORY: 13
D14 D16 = 74xx_GruS:74*1G04: SN74AHC1G04 Single Schmitt-Trigger Inverter Gate Source: Datasheet
H1 H2 H14-H45 = led_GruS:LED: LED, EN-60617 OSRAM: - CHIPLED LG R971, LG N971, LY N971, LG Q971, LY Q971, LO R971, LY R971 LH N974, LH R974 LS Q976, LO Q976, LY Q976 LO Q996 - Hyper CHIPLED LW Q18S LB Q993, LB Q99A, LB R99A - SideLED LS A670, LO A670, LY A670, LG A670, LP A670 LB A673, LV A673, LT A673, LW A673 LH A674 LY A675 LS A676, LA A676, LO A676, LY A676, LW A676 LS A679, LY A679, LG A679 - Hyper Micro SIDELED® LS Y876, LA Y876, LO Y876, LY Y876 LT Y87S - SmartLED LW L88C, LW L88S LB L89C, LB L89S, LG L890 LS L89K, LO L89K, LY L89K LS L896, LA L896, LO L896, LY L896 - TOPLED LS T670, LO T670, LY T670, LG T670, LP T670 LSG T670, LSP T670, LSY T670, LOP T670, LYG T670 LG T671, LOG T671, LSG T671 LB T673, LV T673, LT T673, LW T673 LH T674 LS T676, LA T676, LO T676, LY T676, LB T676, LH T676, LSB T676, LW T676 LB T67C, LV T67C, LT T67C, LS T67K, LO T67K, LY T67K, LW E67C LS E67B, LA E67B, LO E67B, LY E67B, LB E67C, LV E67C, LT E67C LW T67C LS T679, LY T679, LG T679 LS T770, LO T770, LY T770, LG T770, LP T770 LB T773, LV T773, LT T773, LW T773 LH T774 LS E675, LA E675, LY E675, LS T675 LS T776, LA T776, LO T776, LY T776, LB T776 LHGB T686 LT T68C, LB T68C - Hyper Mini TOPLED® LB M676 - Mini TOPLED Santana® LG M470 LS M47K, LO M47K, LY M47K Source: http://www.osram.convergy.de LUXEON: - LUMILED® LXK2-PW12-R00, LXK2-PW12-S00, LXK2-PW14-U00, LXK2-PW14-V00 LXK2-PM12-R00, LXK2-PM12-S00, LXK2-PM14-U00 LXK2-PE12-Q00, LXK2-PE12-R00, LXK2-PE12-S00, LXK2-PE14-T00, LXK2-PE14-U00 LXK2-PB12-K00, LXK2-PB12-L00, LXK2-PB12-M00, LXK2-PB14-N00, LXK2-PB14-P00, LXK2-PB14-Q00 LXK2-PR12-L00, LXK2-PR12-M00, LXK2-PR14-Q00, LXK2-PR14-R00 LXK2-PD12-Q00, LXK2-PD12-R00, LXK2-PD12-S00 LXK2-PH12-R00, LXK2-PH12-S00 LXK2-PL12-P00, LXK2-PL12-Q00, LXK2-PL12-R00 Source: www.luxeon.com KINGBRIGHT: KA-3528ASYC Source: www.kingbright.com; CATEGORY: 7
H3-H10 = led_GruS:PL9823; CATEGORY: 7
H11-H13 = display_GruS:HD-H103: LED DISPLAY 1-character 7 segment, decimal point right; CATEGORY: 15; OC_FARNELL: unknown; OC_NEWARK: unknown
R1 R2 R7-R9 R14-R21 R28 R43-R49 = rcl_GruS:R-EUS: RESISTOR, European symbol
R3-R6 R10-R13 = rcl_GruS:P160: Datasheet P160 DigiKey Collection
R22-R27 R29-R42 = rcl_GruS:R-EU_: RESISTOR, European symbol
S1-S14 = switch_GruS:TASTE10XX: OMRON SWITCH; CATEGORY: 17
S15 = switch_GruS:EC11: Alps 9 Pulse Incremental Mechanical Rotary Encoder with a 6 mm Flat Shaft (Not Indexed), Through Hole// Source: Datasheet; CATEGORY: 17; DESCRIPTION: Alps 9 Pulse Incremental Mechanical Rotary Encoder with a 6 mm Flat Shaft (Not Indexed), Through Hole//; HEIGHT: 24.5mm; MANUFACTURER_NAME: ALPS; MANUFACTURER_PART_NUMBER: EC11E09244AQ; MOUSER_PART_NUMBER: 688-EC11E09244AQ; MOUSER_PRICE-STOCK: https://www.mouser.com/Search/Refine.aspx?Keyword=688-EC11E09244AQ
V1 V26-V28 = mfet_GruS:NTR4003; CATEGORY: 5
V2-V25 = diode_GruS:1N4148: DIODE, EN-60617, high speed Datasheet Dist.: RS Components Art. Nr.: 146-2253; CATEGORY: 5
X1 = modul_GruS:ESP32
X2 = con-lsta:FE06-1: FEMALE HEADER; CATEGORY: 18